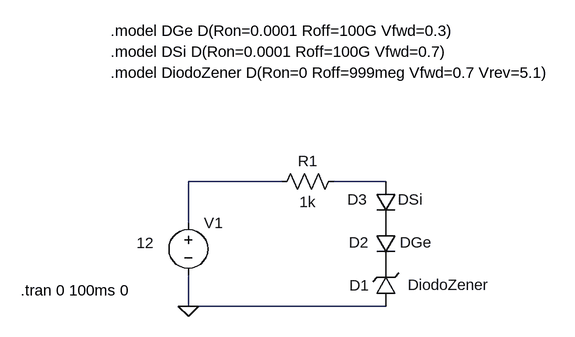
[diagram p0: schematic Lista Zener Ex6.asc]
Lista Zener Ex6.asc, the LTspice schematic file:
Version 4
SHEET 1 880 680
WIRE 16 64 -128 64
WIRE 176 64 96 64
WIRE -128 128 -128 64
WIRE -128 256 -128 208
WIRE 176 256 -128 256
FLAG -128 256 0
SYMBOL res 112 48 R90
WINDOW 0 0 56 VBottom 2
WINDOW 3 32 56 VTop 2
SYMATTR InstName R1
SYMATTR Value 1k
SYMBOL voltage -128 112 R0
WINDOW 3 -80 47 Left 2
WINDOW 123 0 0 Left 0
WINDOW 39 0 0 Left 0
SYMATTR InstName V1
SYMATTR Value 12
SYMBOL zener 192 256 R180
WINDOW 0 41 32 Left 2
WINDOW 3 -145 33 Left 2
SYMATTR InstName D1
SYMATTR Value DiodoZener
SYMBOL diode 160 128 R0
WINDOW 0 -41 30 Left 2
WINDOW 3 38 30 Left 2
SYMATTR InstName D2
SYMATTR Value DGe
SYMBOL diode 160 64 R0
WINDOW 0 -43 28 Left 2
WINDOW 3 35 28 Left 2
SYMATTR InstName D3
SYMATTR Value DSi
TEXT -248 -104 Left 2 !.model DiodoZener D(Ron=0 Roff=999meg Vfwd=0.7 Vrev=5.1)
TEXT -386 232 Left 2 !.tran 0 100ms 0
TEXT -248 -136 Left 2 !.model DSi D(Ron=0.0001 Roff=100G Vfwd=0.7)
TEXT -248 -168 Left 2 !.model DGe D(Ron=0.0001 Roff=100G Vfwd=0.3)

The netlist it stands for:
* Lista Zener Ex6.asc
R1 N002 N001 1k
V1 N001 0 12
D1 0 P001 DiodoZener
D2 P002 P001 DGe
D3 N002 P002 DSi
.model D D
.lib standard.dio
.model DiodoZener D(Ron=0 Roff=999meg Vfwd=0.7 Vrev=5.1)
.tran 0 100ms 0
.model DSi D(Ron=0.0001 Roff=100G Vfwd=0.7)
.model DGe D(Ron=0.0001 Roff=100G Vfwd=0.3)
.backanno
.end